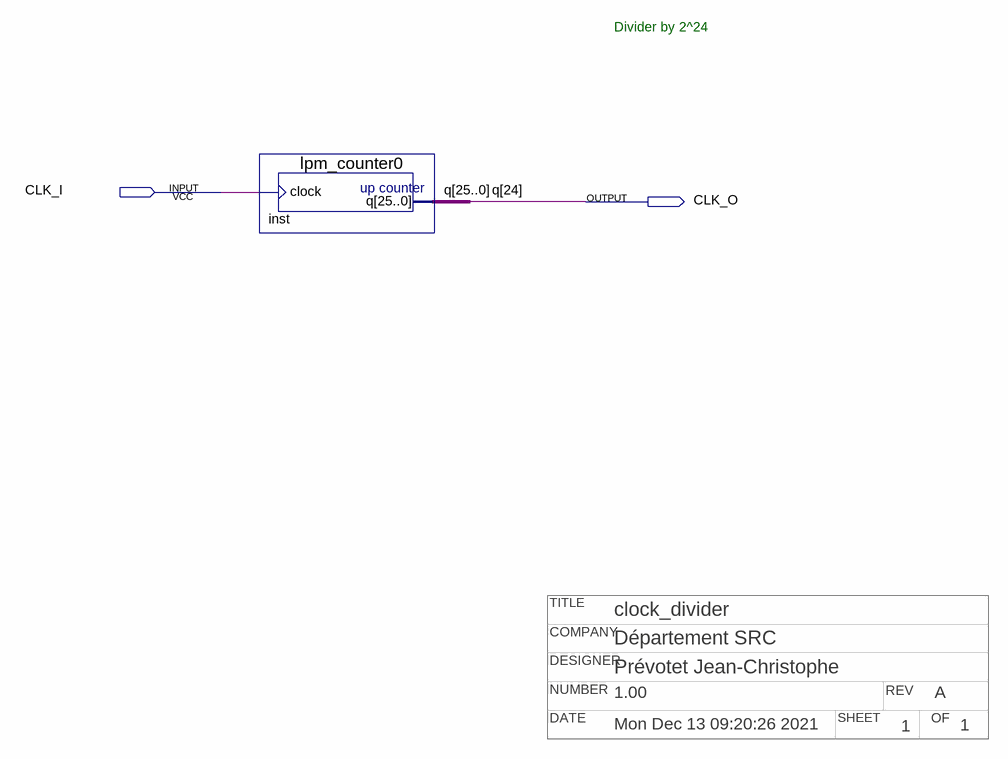
[diagram p0: schematic sheet]
// Quartus schematic clock_divider.bdf as structural Verilog: 1 symbols, 2 pins
// Title block: COMPANY: Département SRC; DATE: Mon Dec 13 09:20:26 2021; DESIGNER: Prévotet Jean-Christophe; NUMBER: 1.00; OF: 1; REV: A; SHEET: 1; TITLE: clock_divider
module clock_divider (
  input  CLK_I,
  output CLK_O
);

  wire [25:0] q;

  lpm_counter0 inst (.clock(CLK_I), .q({q[25], CLK_O, q[23:0]}));

  // Other names for the same wires on the sheet: q[24] = CLK_O

  // Notes on the sheet:
  //   Divider by 2^24
endmodule
